# Altium project IgnitionDriverChipV2.PrjPcb
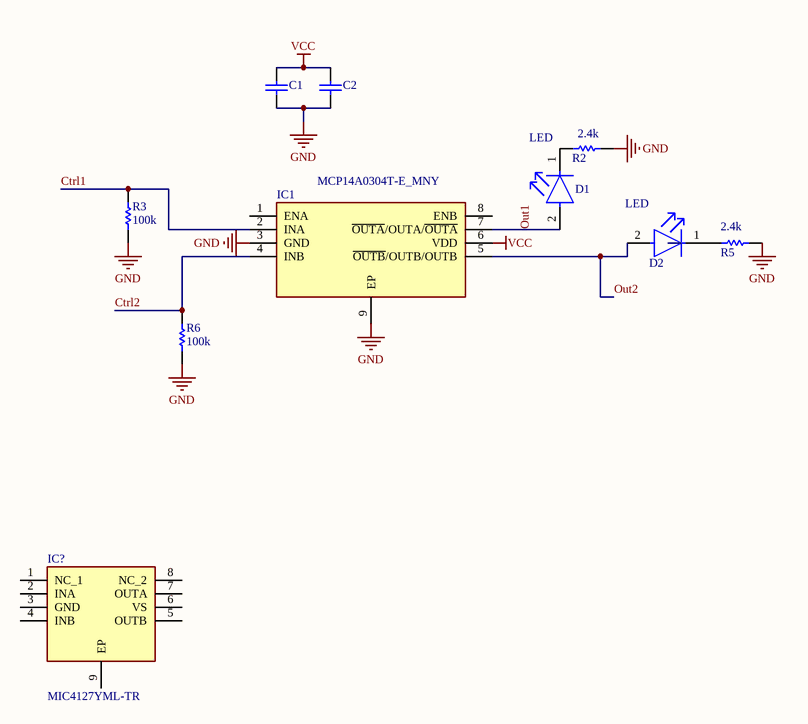
[diagram p0: DriverChip.SchDoc]
1 sheet, 10 parts. Net scope: global (net labels, ports and power ports of the same name join across sheets).
Board file: DriverChip.PcbDoc

## Sheet DriverChip.SchDoc
size A; SheetNumber: 1; SheetTotal: 1

### Parts
C1  C0603C105K3PAC7867  [CAPC1608X90X35NL15T15]  (value not drawn)
C2  C0603C105K3PAC7867  [CAPC1608X90X35NL15T15]  (value not drawn)
D1  LED  [FP-LTST-C191TBKT-MFG]
D2  LED  [FP-LTST-C191TBKT-MFG]
IC1  MCP14A0304T-E_MNY  [SON50P300X200X80-9N-D]
IC?  MIC4127YML-TR  [SON65P300X300X100-9N-D]
R2  2.4k  [RESC1608X55X30ML20T20]
R3  100k  [RESC1608X55X30ML15T15]
R5  2.4k  [RESC1608X55X30ML20T20]
R6  100k  [RESC1608X55X30ML15T15]

### Nets
GND: C1.1 C2.1 IC1.3(GND) IC1.9(EP) R2.1 R3.2 R5.1 R6.2
VCC: C1.2 C2.2 IC1.6(VDD)
Ctrl1: IC1.2(INA) R3.1
Ctrl2: IC1.4(INB) R6.1
Out1: D1.2(A) IC1.7(~{OUTA}/OUTA/~{OUTA})
Out2: D2.2(A) IC1.5(~{OUTB}/OUTB/OUTB)
NetD1_1: D1.1(C) R2.2
NetD2_1: D2.1(C) R5.2

Not connected (* = marked no-connect by the designer): IC1 1(ENA) 8(ENB); IC? 1(NC_1) 2(INA) 3(GND) 4(INB) 5(OUTB) 6(VS) 7(OUTA) 8(NC_2) 9(EP)

### Library data of the parts
C1 C2 = CMP-2006-02216-2: Manufacturer: Kemet; Part Number: C0603C105K3PAC7867
D1 D2 = CMP-22017-000008-1: LED BLUE CLEAR CHIP SMD; Lens Color: Colorless; Dominant Wavelength: 475nm; Forward Current: 20mA; Wavelength: 468nm; Viewing Angle: 130°; Power Dissipation: 76mW; Luminous Intensity: 180mcd; Reverse Voltage: 5V; Number of Elements: 1; Lens Style: Diffused; Forward Voltage: 3.8V; Max Power Dissipation: 75mW; Case Code (Metric): 1608; Packaging: Tape and Reel; Case/Package: 0603; Depth: 1.6mm; Mount: Surface Mount; Lead Free: Lead Free; Min Operating Temperature: -20°C; Lens Transparency: Clear; Illumination Color: Blue; Height: 0.55mm; Test Current: 20mA; Case Code (Imperial): 0603; Max Operating Temperature: 80°C; Number of Pins: 2; Length: 0.8mm; Radiation Hardening: No; Package Quantity: 1; Number of LEDs: 1; Width: 0.8mm; Color: Blue
IC1 = MCP14A0304T-E_MNY: Integrated Circuit; Manufacturer_Name: Microchip; Manufacturer_Part_Number: MCP14A0304T-E/MNY; Datasheet Link: https://componentsearchengine.com/Datasheets/1/MCP14A0304T-E_MNY.pdf; Height: 0.8mm; Mouser Part Number: 579-MCP14A0304T-E/MN; Mouser Price/Stock: https://www.mouser.co.uk/ProductDetail/Microchip-Technology/MCP14A0304T-E-MNY?qs=w%2Fv1CP2dgqr6wcJcG4624Q%3D%3D
IC? = MIC4127YML-TR: Integrated Circuit; Manufacturer_Name: Microchip; Datasheet Link: https://ww1.microchip.com/downloads/en/DeviceDoc/MIC4126-27-28-Data-Sheet-20006084A.pdf; Height: 1mm; Manufacturer_Part_Number: MIC4127YML-TR; Mouser Part Number: 998-MIC4127YMLTR; Mouser Price/Stock: https://www.mouser.com/Search/Refine.aspx?Keyword=998-MIC4127YMLTR
R2 R5 = CMP-2000-00965-1: Manufacturer: Panasonic; Part Number: ERA3AEB242V
R3 R6 = CMP-2000-00182-1: Part Number: ERJ-3EKF1003V; Manufacturer: Panasonic

## Assembly variants
Variant of IgnitionDriverChipV2 (MIC4127YML-TR): all parts fitted